# EAGLE design patch_antenna_900MHz (EAGLE 9.6.2)
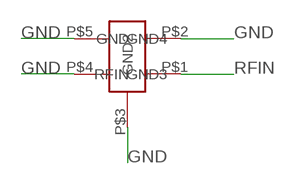
[diagram p0: schematic, sheet 1]

## Parts
U$1  PSF-S01  [PSF-S01]

## Nets
GND: U$1.P$2(GND) U$1.P$3(GND2) U$1.P$4(GND3) U$1.P$5(GND4)
RFIN: U$1.P$1(RFIN)

## Library data of the parts
U$1 = PSF-S01:PSF-S01

## Board
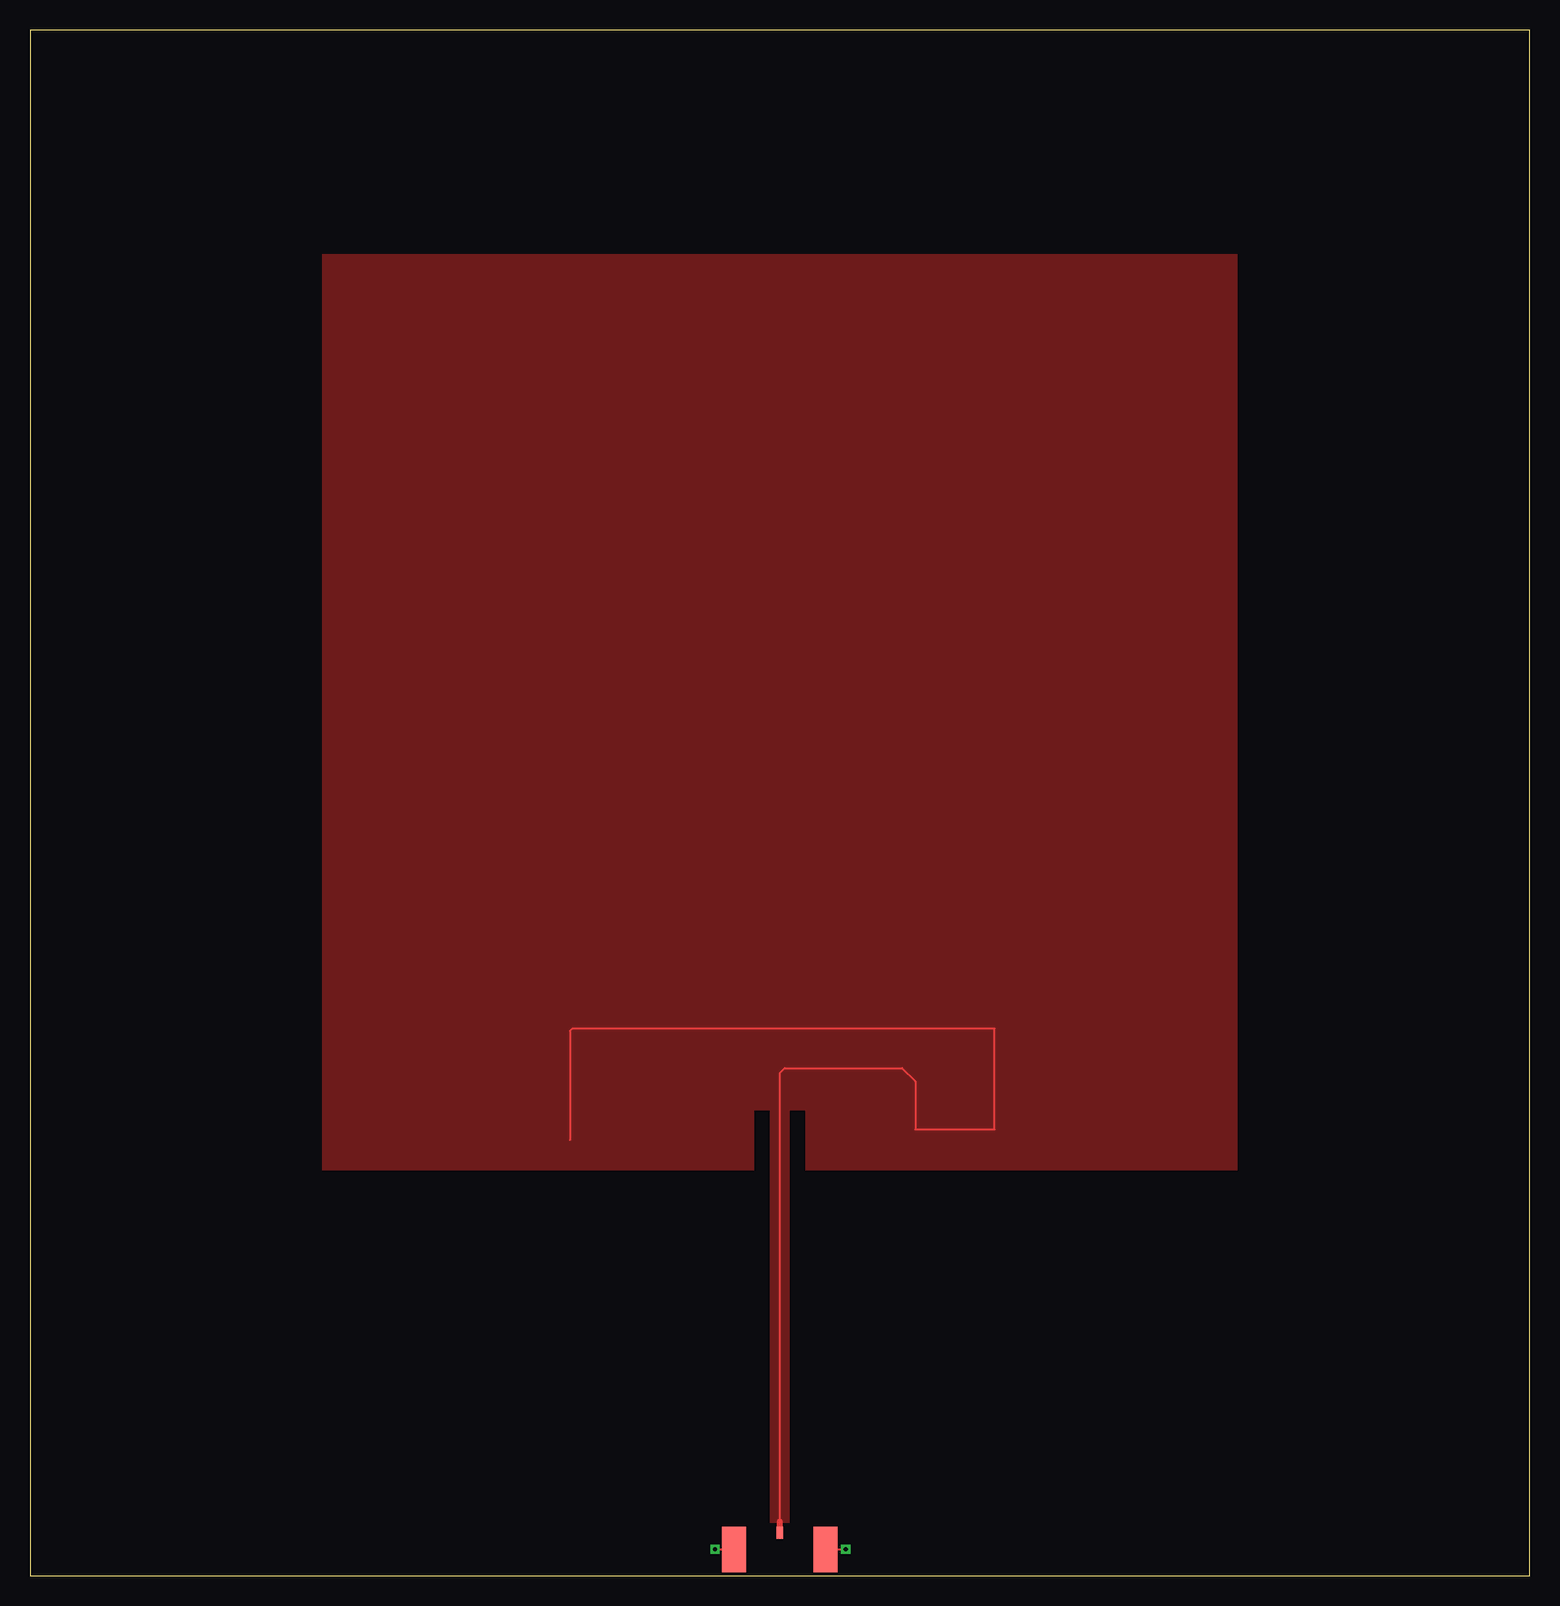
[diagram p1: board, top side]
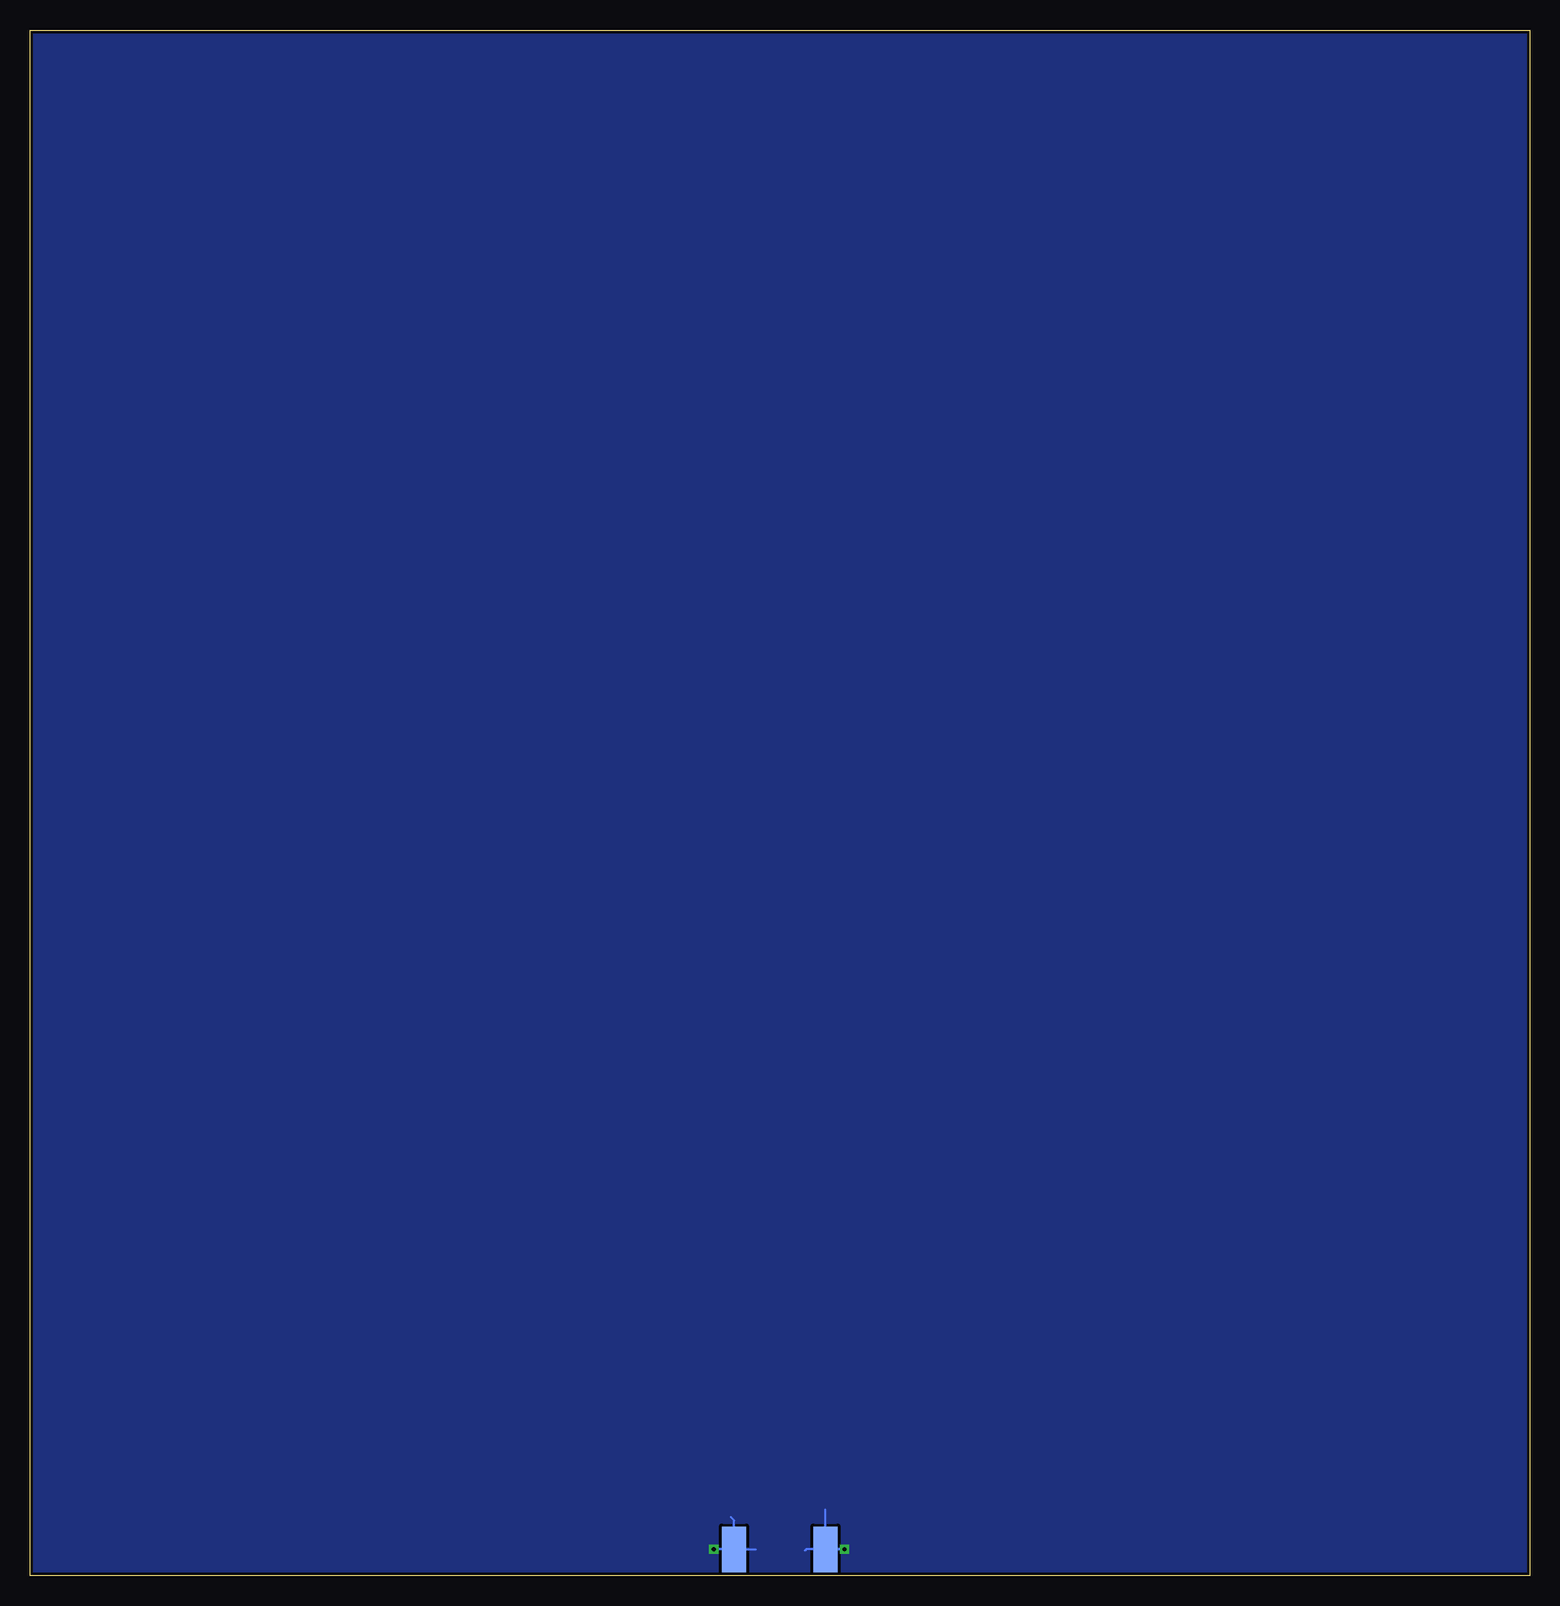
[diagram p2: board, bottom side, seen from below]

Size 125 x 128.81 mm. Coordinates in mm from the lower left corner, seen from the top.
Outline: 0,0 125,0 125,128.81 0,128.81 0,0
Copper layers (1*16): Top 0.035mm / dielectric 1.53mm / Bottom 0.035mm
Design rules "default *": minimum track width 6mil, minimum drill 0.35mm, track to track 6mil, track to pad 6mil, pad to pad 6mil, via to via 6mil, smd to smd 6mil, copper to edge 10mil, drill to drill 6mil, minimum pad ring 10mil, minimum via ring 8mil, stop-mask expansion 4mil, vias tented up to drill 0mil, thermal gap 10mil

### Footprints (pad centres in the part's own frame; a part is rotated, then mirrored left to right if it is on the bottom)
PSF-S01 = smd 1.001 x 0.518: P$1 0.5,0 | smd 3.81 x 2.032: P$2 1.905,3.81; P$3 1.905,-3.81 | smd 3.81 x 2.032 bottom: P$4 1.905,3.81; P$5 1.905,-3.81

### Placement (x,y rotation side)
U$1  62.5,4.1 270 top

### Tracks (layer width: path | path; a pad name or v marks a point on that pad's centre or on a via)
GND  (via drill 0.35)
  Top 0.152: v57.1,2.2 58.49,2.2 U$1.P$5 | U$1.P$4 66.5,2.2 v68,2.2
  Bottom 0.152: U$1.P$5 56.8,2.19 56.8,2.2 58.49,2.2 U$1.P$5 | U$1.P$5 58.69,5.35 58.7,5.5 | U$1.P$5 60.3,2.19 60.4,2.1 | U$1.P$4 64.5,2.19 64.5,2.2 | U$1.P$4 66.31,4.61 66.6,4.9 | U$1.P$4 66.5,2.2 68.1,2.2
  pour Bottom: 0,0 125,0 125,128.81 0,128.81
RFIN
  Top 0.152: 62.5,4.5 62.5,41.9 62.9,42.3 72.7,42.3 73.8,41.2 73.8,37.2 80.4,37.2 80.4,45.6 45.2,45.6 45,45.4 45,36.3
  Top 0.518: U$1.P$1 62.5,4.5
  pour Top: 61.7,4.41 63.3,4.41 63.3,38.81 61.7,38.81
  pour Top: 64.66,33.81 100.66,33.81 100.66,38.81 64.66,38.81
  pour Top: 24.34,38.81 100.66,38.81 100.66,110.13 24.34,110.13
  pour Top: 24.34,33.81 60.34,33.81 60.34,38.81 24.34,38.81